# EAGLE schematic thermistor (EAGLE 6.0)
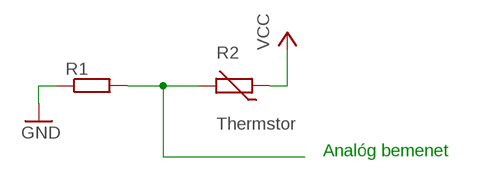
[diagram p0: schematic, sheet 1]

## Parts
R1  R-EU_0204/7  [0204/7]
R2  Thermstor  THERMISTOR-5  [R-5]

## Nets
GND: R1.1
N$1: R1.2 R2.2
VCC: R2.1

## Notes on the sheet
- Analóg bemenet

## Library data of the parts
R1 = resistor:R-EU_: RESISTOR, European symbol
R2 = varistor:THERMISTOR: THERMISTOR